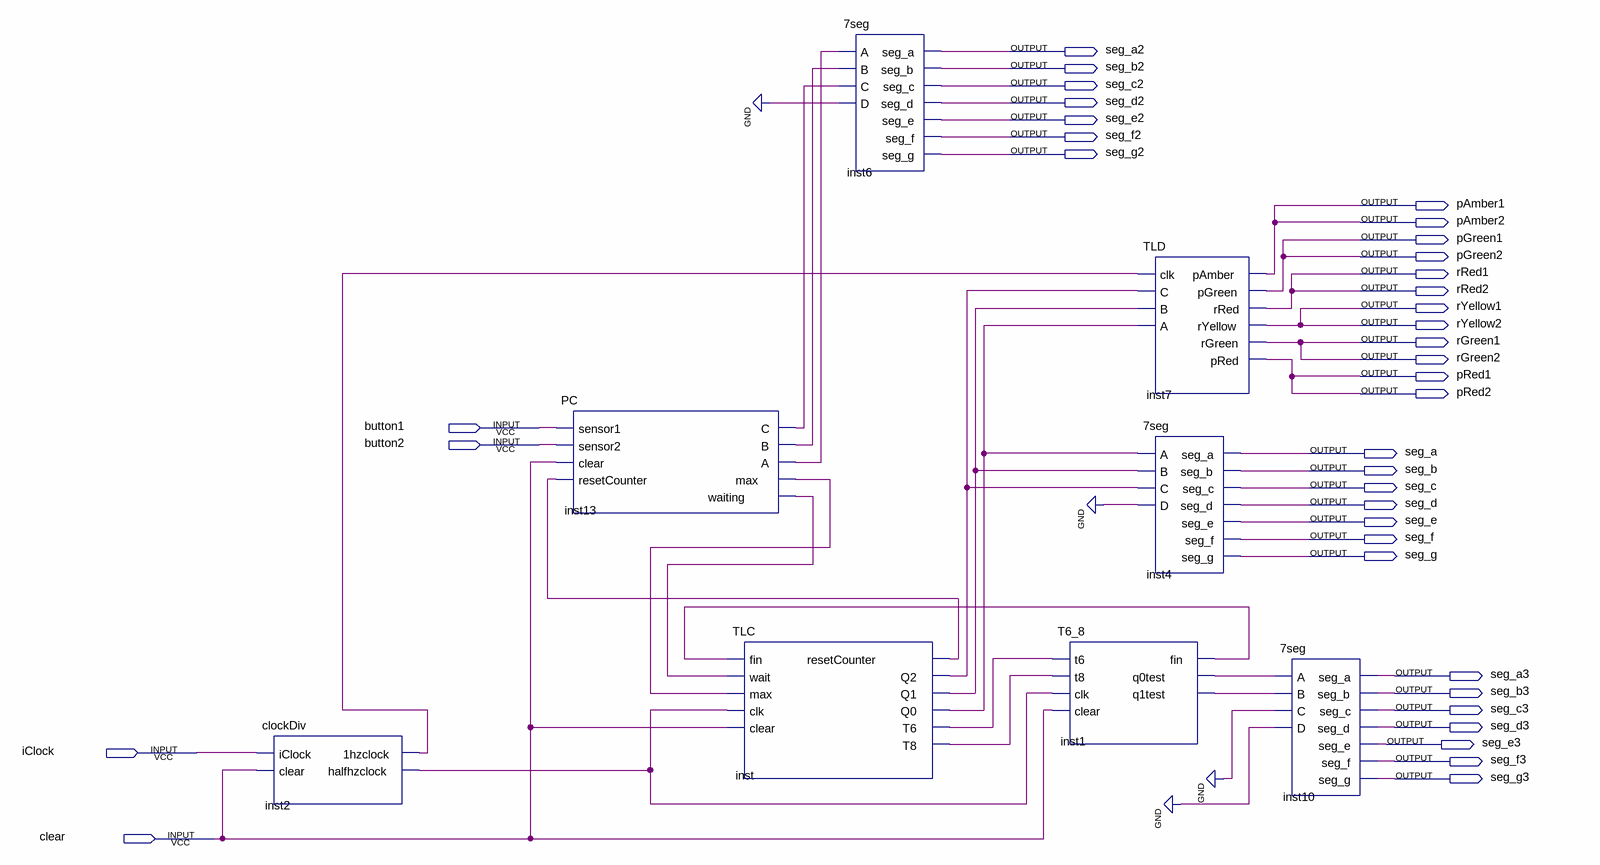
[diagram p0: schematic sheet]
// Quartus schematic Master.bdf as structural Verilog: 8 symbols, 37 pins
module Master (
  input  button1,
  input  button2,
  input  iClock,
  input  clear,
  output seg_a2,
  output seg_b2,
  output seg_c2,
  output seg_d2,
  output seg_e2,
  output seg_f2,
  output seg_g2,
  output pAmber1,
  output pAmber2,
  output pGreen1,
  output pGreen2,
  output rRed1,
  output rRed2,
  output rYellow1,
  output rYellow2,
  output rGreen1,
  output rGreen2,
  output pRed1,
  output pRed2,
  output seg_a,
  output seg_b,
  output seg_c,
  output seg_d,
  output seg_e,
  output seg_f,
  output seg_g,
  output seg_a3,
  output seg_b3,
  output seg_c3,
  output seg_d3,
  output seg_e3,
  output seg_f3,
  output seg_g3
);

  wire inst1_fin, inst1_q0test, inst1_q1test, inst2_1hzclock, inst2_halfhzclock, inst13_a, inst13_b,
       inst13_c, inst13_max, inst13_waiting, inst_q0, inst_q1, inst_q2, inst_resetcounter, inst_t6, inst_t8;

  clockDiv inst2 (.iClock(iClock), .clear(clear), .\1hzclock (inst2_1hzclock), .halfhzclock(inst2_halfhzclock));
  PC inst13 (
    .sensor1(button1), .sensor2(button2), .clear(clear), .resetCounter(inst_resetcounter), .C(inst13_c),
    .B(inst13_b), .A(inst13_a), .max(inst13_max), .waiting(inst13_waiting));
  TLC inst (
    .fin(inst1_fin), .\wait (inst13_waiting), .max(inst13_max), .clk(inst2_halfhzclock), .clear(clear),
    .resetCounter(inst_resetcounter), .Q2(inst_q2), .Q1(inst_q1), .Q0(inst_q0), .T6(inst_t6), .T8(inst_t8));
  \7seg  inst6 (
    .A(inst13_a), .B(inst13_b), .C(inst13_c), .D(1'b0), .seg_a(seg_a2), .seg_b(seg_b2), .seg_c(seg_c2),
    .seg_d(seg_d2), .seg_e(seg_e2), .seg_f(seg_f2), .seg_g(seg_g2));
  T6_8 inst1 (
    .t6(inst_t6), .t8(inst_t8), .clk(inst2_halfhzclock), .clear(clear), .fin(inst1_fin),
    .q0test(inst1_q0test), .q1test(inst1_q1test));
  TLD inst7 (
    .clk(inst2_1hzclock), .C(inst_q2), .B(inst_q1), .A(inst_q0), .pAmber(pAmber1), .pGreen(pGreen1),
    .rRed(rRed1), .rYellow(rYellow1), .rGreen(rGreen1), .pRed(pRed1));
  \7seg  inst4 (
    .A(inst_q0), .B(inst_q1), .C(inst_q2), .D(1'b0), .seg_a(seg_a), .seg_b(seg_b), .seg_c(seg_c),
    .seg_d(seg_d), .seg_e(seg_e), .seg_f(seg_f), .seg_g(seg_g));
  \7seg  inst10 (
    .A(inst1_q0test), .B(inst1_q1test), .C(1'b0), .D(1'b0), .seg_a(seg_a3), .seg_b(seg_b3), .seg_c(seg_c3),
    .seg_d(seg_d3), .seg_e(seg_e3), .seg_f(seg_f3), .seg_g(seg_g3));

  assign pAmber2 = pAmber1;
  assign pGreen2 = pGreen1;
  assign pRed2 = pRed1;
  assign rGreen2 = rGreen1;
  assign rRed2 = rRed1;
  assign rYellow2 = rYellow1;
endmodule
